# Altium schematic sheet MainBoard_Motor2.SchDoc
size A3
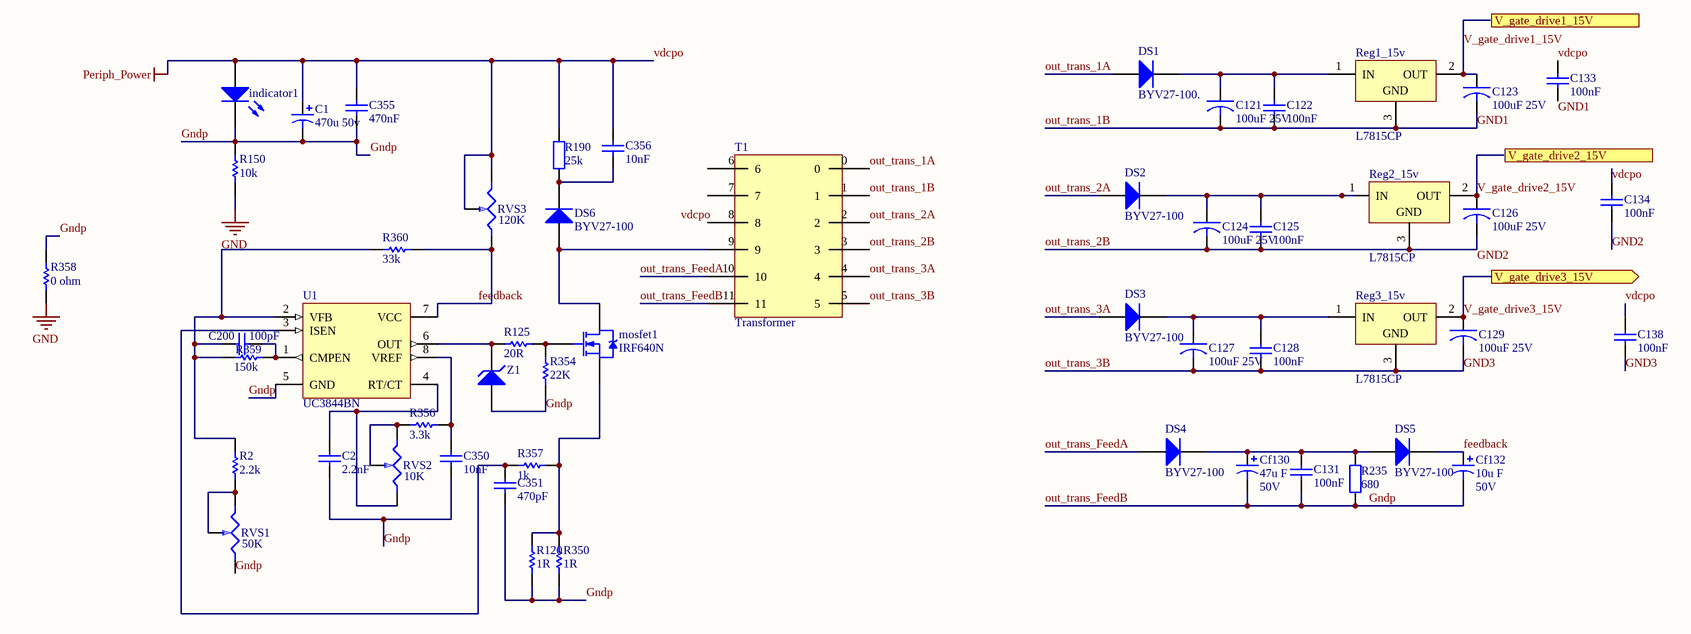
[diagram p0: MainBoard_Motor2.SchDoc]

## Parts
C1  470u 50v  [CAPPR5-5x5]
C2  2.2nF  [C0805]
C121  100uF 25V  [CAP_E_6.3x9_2.5]
C122  100nF  [C0805]
C123  100uF 25V  [CAP_E_6.3x9_2.5]
C124  100uF 25V  [CAP_E_6.3x9_2.5]
C125  100nF  [C0805]
C126  100uF 25V  [CAP_E_6.3x9_2.5]
C127  100uF 25V  [CAP_E_6.3x9_2.5]
C128  100nF  [C0805]
C129  100uF 25V  [CAP_E_6.3x9_2.5]
C131  100nF  [C0805]
C133  100nF  [C0805]
C134  100nF  [C0805]
C138  100nF  [C0805]
C200  100pF  [C0805]
C350  10nF  [C0805]
C351  470pF  [C0805]
C355  470nF  [C0805]
C356  10nF  [C0805]
Cf130  47u F  value 50V  [B]
Cf132  10u F  value 50V  [B]
DS1  BYV27-100.  [DO-41]
DS2  BYV27-100  [DO-41]
DS3  BYV27-100  [DO-41]
DS4  BYV27-100  [DO-41]
DS5  BYV27-100  [DO-41]
DS6  BYV27-100  [DO-41]
indicator1  GREEN  [LED_0805_GREEN]  (value not drawn)
mosfet1  IRF640N  [TO-220AB]
R2  2.2k  [R0805]
R120  1R  [R1206]
R125  20R  [R1206]
R150  10k  [R1206]
R190  25k  [AXIAL-0.6]
R235  680  [AXIAL-0.5]
R350  1R  [R1206]
R354  22K  [R0805]
R356  3.3k  [R0805]
R357  1k  [R0805]
R358  0 ohm  [R0805]
R359  150k  [R1206]
R360  33k  [R1206]
Reg1_15v  L7815CP  [TO220VW]
Reg2_15v  L7815CP  [TO220VW]
Reg3_15v  L7815CP  [TO220VW]
RVS1  50K  [VR5]
RVS2  10K  [VR5]
RVS3  120K  [VR5]
T1  Transformer
U1  UC3844BN  [626-05]
Z1  D Zener  [DO-35]  (value not drawn)

## Ports
V_gate_drive1_15V (out), V_gate_drive2_15V (out), V_gate_drive3_15V (out)

## Nets
GND: R150.1 R358.1
vdcpo: C1.1 C133.2 C134.2 C138.2 C355.2 C356.2 indicator1.1(A) R190.2 RVS3.1(A) RVS3.2(WIPER)  [also labelled Periph_Power]
feedback: Cf132.1 DS5.2(K) R360.2 RVS3.3(B) U1.7(VCC)
GND1: C121.2 C122.1 C123.2 Reg1_15v.3(GND) T1.1  [also labelled out_trans_1B]
GND2: C134.1
GND3: C127.2 C128.1 C129.2 C138.1 Reg3_15v.3(GND) T1.5  [also labelled out_trans_3B]
Gndp: C1.2 C2.1 C131.1 C350.1 C351.1 C355.1 Cf130.2 Cf132.2 indicator1.2(K) R120.2 R150.2 R235.1 R350.2 R354.1 R358.2 RVS1.3(B) T1.11 U1.5(GND) Z1.1(A)  [also labelled out_trans_FeedB]
out_trans_1A: DS1.1(A) T1.0
out_trans_2A: DS2.1(A) T1.2
out_trans_2B: C124.2 C125.1 C126.2 Reg2_15v.3(GND) T1.3
out_trans_3A: DS3.1(A) T1.4
out_trans_FeedA: DS4.1(A) T1.10
V_gate_drive1_15V: C123.1 Reg1_15v.2(OUT)
V_gate_drive2_15V: C126.1 Reg2_15v.2(OUT)
V_gate_drive3_15V: C129.1 Reg3_15v.2(OUT) ; port V_gate_drive3_15V
NetC2_2: C2.2 RVS2.3(B) U1.4(RT/CT)
NetC121_1: C121.1 C122.2 DS1.2(K) Reg1_15v.1(IN)
NetC124_1: C124.1 C125.2 DS2.2(K) Reg2_15v.1(IN)
NetC127_1: C127.1 C128.2 DS3.2(K) Reg3_15v.1(IN)
NetC131_2: C131.2 Cf130.1 DS4.2(K) DS5.1(A) R235.2
NetC200_1: C200.1 R2.2 R359.1 R360.1 U1.2(VFB)
NetC200_2: C200.2 R359.2 U1.1(CMPEN)
NetC350_2: C350.2 R356.2 U1.8(VREF)
NetC351_2: C351.2 R357.1 U1.3(ISEN)
NetC356_1: C356.1 DS6.2(K) R190.1
NetDS6_1: DS6.1(A) mosfet1.2(D) T1.9
Netmosfet1_1: mosfet1.1(G) R125.2 R354.2
Netmosfet1_3: mosfet1.3(S) R120.1 R350.1 R357.2
NetR2_1: R2.1 RVS1.1(A) RVS1.2(WIPER)
NetR125_1: R125.1 U1.6(OUT) Z1.2(K)
NetR356_1: R356.1 RVS2.1(A) RVS2.2(WIPER)

Not connected (* = marked no-connect by the designer): C133 1; T1 6 7 8

## Notes on the sheet
- Labels drawn without touching a wire or pin: GND1, GND2, vdcpo

## Library data of the parts
C1 Cf130 Cf132 = Cap Pol1: Polarized Capacitor (Radial); Published: 8-Jun-2000; LatestRevisionDate: 17-Jul-2002; LatestRevisionNote: Re-released for DXP Platform.; PackageReference: RB7.6-15; Publisher: Altium Limited
C2 = Cap_10nF_50V_0805: Cap_2.2nF_10%_X7R_50V_0805; Manufacturer: Yageo; MFR PART NO: CC0805KRX7R9BB103; SAP: 10020252
C121 C123 C124 C126 C127 C129 = Cap_100uF 25V_EL_6.3MM: Cap_100uF 25V_Pitch2.5mm; MFR PART NO: ERS1EM101E11OT; Manufacturer: AIHUA
C122 C125 C128 C131 C133 C134 C138 C350 C351 C355 C356 = Cap_10nF_50V_0805: Cap_10nF_10%_X7R_50V_0805; Manufacturer: Yageo; MFR PART NO: CC0805KRX7R9BB103; SAP: 10020252
C200 = Cap_100pF_50V_0805: Cap_100pF_10%_X7R_50V_0805; Manufacturer: Yageo; MFR PART NO: CC0805KRX7R9BB101; SAP: 10020251
DS1-DS5 = Diode 1N4007: 1 Amp General Purpose Rectifier SMD; Published: 8-Jun-2000; LatestRevisionDate: 17-Jul-2002; LatestRevisionNote: Re-released for DXP Platform.; DatasheetDocument: 1998; PackageDocument: Aug-1999; PackageReference: DO-41; Publisher: Altium Limited; Code_JEDEC: DO-204-AL; ComponentLink1Description: Manufacturer Link; ComponentLink1URL: http://www.fairchildsemi.com/; ComponentLink2Description: Datasheet; ComponentLink2URL: http://www.fairchildsemi.com/ds/1N%2F1N4001.pdf
DS6 = Diode 1N4007: 1 Amp General Purpose Rectifier; Published: 8-Jun-2000; LatestRevisionDate: 17-Jul-2002; LatestRevisionNote: Re-released for DXP Platform.; DatasheetDocument: 1998; PackageDocument: Aug-1999; PackageReference: DO-41; Publisher: Altium Limited; Code_JEDEC: DO-204-AL; ComponentLink1Description: Manufacturer Link; ComponentLink1URL: http://www.fairchildsemi.com/; ComponentLink2Description: Datasheet; ComponentLink2URL: http://www.fairchildsemi.com/ds/1N%2F1N4001.pdf
indicator1 = LED3: Typical BLUE SiC LED; Manufacturer: Kingbright; MFR PART NO: APT2012SGC; Published: 8-Jun-2000; LatestRevisionDate: 17-Dec-2003; LatestRevisionNote: PCB Footprint replaced.; DatasheetVersion: 16-Apr-2002; PackageVersion: 16-Apr-2002; PackageReference: 3.5X2.8X1.9; Publisher: Altium Limited; PackageDescription: SM LED; 2 C-Bend Leads; Body 3.5 x 2.8 x 1.9 mm, inc leads (LxWxH typ); Value: GREEN
mosfet1 = IRF640N: HEXFET Power MOSFET; Note: Pin 2 is electrically connected to Tab (Drain).; Published: 17-Sep-2003; DatasheetVersion: 9-Oct-2000; PackageVersion: Feb-1997; PackageReference: TO-220AB; Publisher: Altium Limited; PackageDescription: TO, Thru-Hole, Vertical, Heatsink Mounted; 3 In-Line Leads; Pitch 2.54 mm; ComponentLink1Description: Manufacturer Link; ComponentLink1URL: http://www.irf.com/; ComponentLink2Description: Datasheet; ComponentLink2URL: http://www.irf.com/product-info/datasheets/data/IRL3714.pdf
R2 R356-R358 = Res_4.7K_0805: Res_2.2K_1%_0805; Manufacturer: Yageo; MFR PART NO: RC0805FR-074K7L; SAP: 10021870
R120 R350 = Res_2.2R_1206: Res_2.2R_1%_1206; Manufacturer: Yageo; MFR PART NO: RC1206FR-072R2L; SAP: 10021874
R125 R150 R359 R360 = Res_20R_1206: Res_20R_1%_0.25W_1206; Manufacturer: Yageo; MFR PART NO: RC1206FR-0720RL; SAP: 10021877
R190 R235 = Res2: Resistor; Published: 8-Jun-2000; LatestRevisionDate: 17-Jul-2002; LatestRevisionNote: Re-released for DXP Platform.; PackageReference: AXIAL-0.4; Publisher: Altium Limited
R354 = Res_4.7K_0805: Res_4.7K_1%_0805; Manufacturer: Yageo; MFR PART NO: RC0805FR-074K7L; SAP: 10021870
Reg1_15v Reg2_15v Reg3_15v = L78S05CV: 2A Positive Voltage Regulator; Note: Tab is connected to pin 3 (GND).; Published: 24-Aug-2001; LatestRevisionDate: 17-Jul-2002; LatestRevisionNote: Re-released for DXP Platform.; DatasheetVersion: Jan-1993; PackageVersion: Apr-1998; PackageReference: TO220VW; Publisher: Altium Limited; PackageDescription: TO, Thru-Hole, Vertical, Heatsink Mounted; 3 In-Line Leads; Pitch 2.54 mm; Pin sequence 1, 3, 2; ComponentLink1Description: Manufacturer Link; ComponentLink1URL: http://www.st.com/; ComponentLink2Description: Datasheet; ComponentLink2URL: http://www.st.com/stonline/products/literature/ds/2148/l78s10c.pdf
RVS1-RVS3 = RESISTOR VAR: Text Field1: 40; Text Field2: 20
T1 = Component_1
U1 = UC3844BN: High Performance Current Mode Controller; Published: 15-Apr-2002; DatasheetVersion: 1996; PackageVersion: 1998; PackageReference: 626-05; Publisher: Altium Limited; PackageDescription: DIP; 8 Leads; Row Spacing 7.62 mm; Pitch 2.54 mm; ComponentLink1Description: Manufacturer Link; ComponentLink1URL: http://www.onsemi.com/site/products/taxonomy/0,4438,503,00.html; ComponentLink2Description: Datasheet; ComponentLink2URL: http://www.onsemi.com/pub/Collateral/UC3844B-D.PDF
Z1 = 1N751A: Half Watt Zener; Published: 8-Jun-2000; LatestRevisionDate: 17-Jul-2002; LatestRevisionNote: Re-released for DXP Platform.; DatasheetDocument: 1997; PackageReference: DO-35; Publisher: Altium Limited; Code_JEDEC: DO-204-AH; ComponentLink1Description: Manufacturer Link; ComponentLink1URL: http://www.fairchildsemi.com/; ComponentLink2Description: Datasheet; ComponentLink2URL: http://www.fairchildsemi.com/ds/1N%2F1N747A.pdf